# Altium project STM32F103C8.PrjPcb
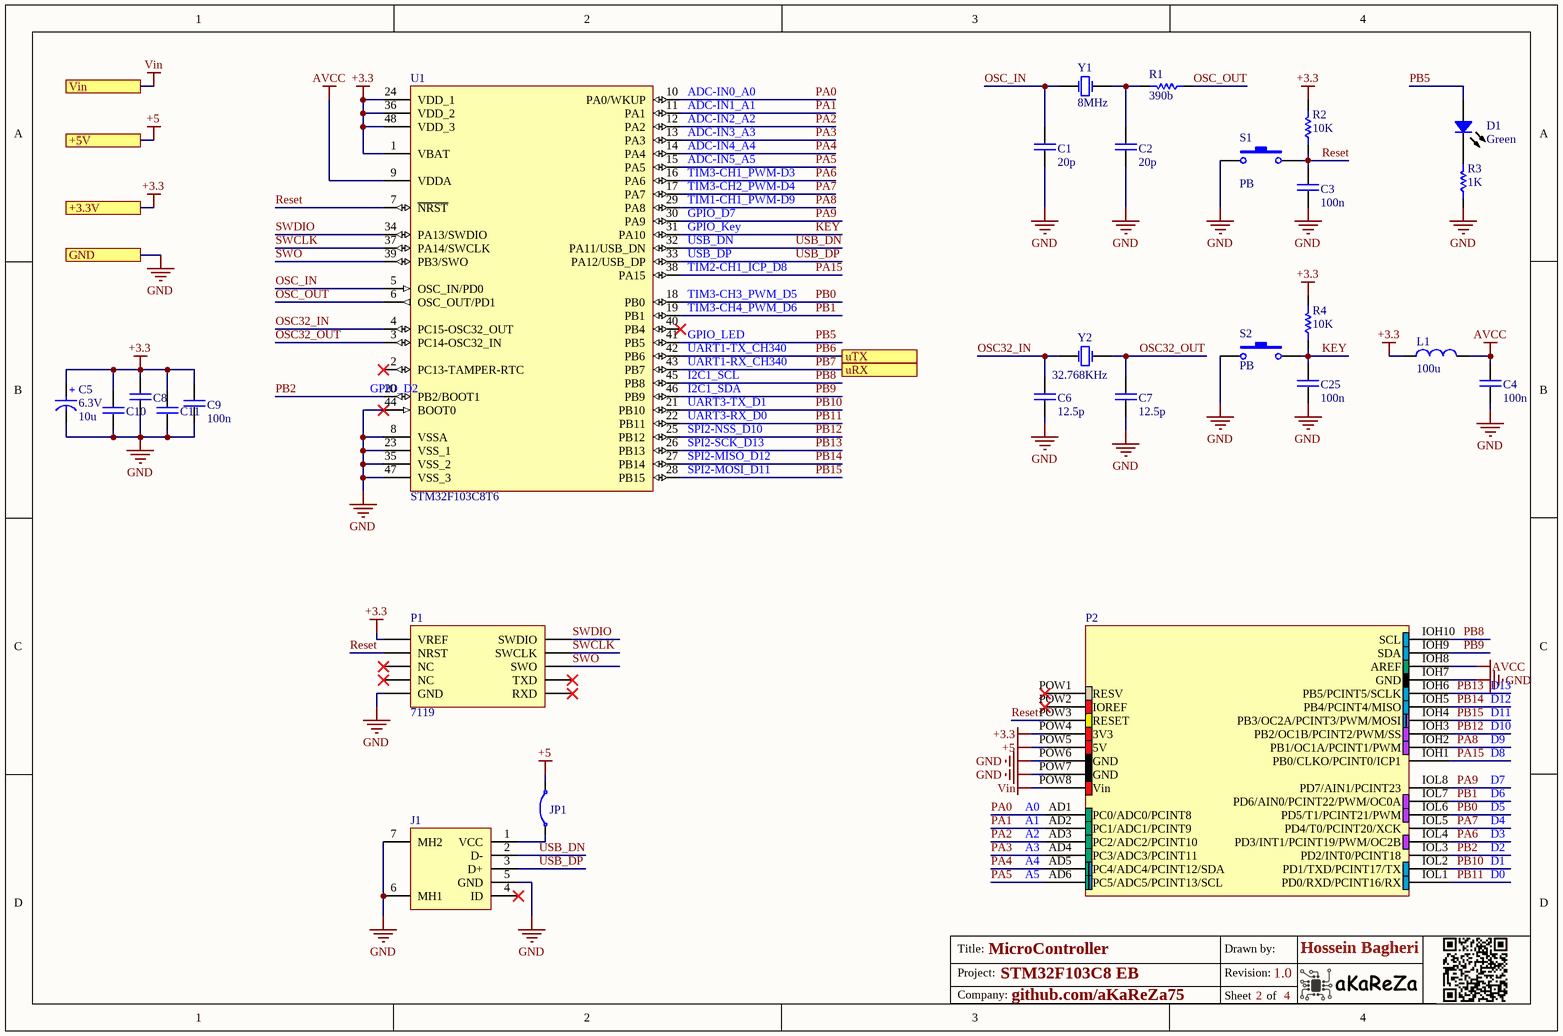
[diagram p0: MicroController.SchDoc]
Revision: 1.0.1; Project_Name: STM32F103C8 EB; CompanyName: github.com/aKaReZa75
2 sheets, 45 parts. Net scope: strictly hierarchical (ports join the sheet entries above them; power ports are local).
Board file: PCB.PcbDoc
Sheets:
  MicroController.SchDoc
  USBtoTTL.SchDoc

## Sheet MicroController.SchDoc: MicroController
size A4; Revision: 1.0; SheetNumber: 2; SheetTotal: 4

### Parts
C1  20p  [CAP 0603/1608]
C2  20p  [CAP 0603/1608]
C3  100n  [CAP 0805/2012]
C4  100n  [CAP 0805/2012]
C5  Rating: 6.3V  [SMT_C_Tantalum_A]  (hidden comment: 10u)
C6  12.5p  [CAP 0603/1608]
C7  12.5p  [CAP 0603/1608]
C8  100n  [CAP 0805/2012]  (value not drawn)
C9  100n  [CAP 0805/2012]
C10  100n  [CAP 0805/2012]  (value not drawn)
C11  100n  [CAP 0805/2012]  (value not drawn)
C25  100n  [CAP 0805/2012]
D1  Green  [LED 0805/2012 GREEN]
J1  Micro  [USB_Micro_Standard]  (value not drawn)
JP1  Jumper  [RESC2012M (0805)]  (value not drawn)
L1  100u  [IND0805]
P1  Inflow: 7119  [IDC2.54-10PIN]  (hidden comment: STLinkV3-minie)
P2  UNO  [ARDUINO_UNO_CONNECTOR]  (value not drawn)
R1  390b  [RES 0805 (2012X06L)]
R2  10K  [RES 0805 (2012X06L)]
R3  1K  [RES 0805 (2012X06L)]
R4  10K  [RES 0805 (2012X06L)]
S1  PB  [SW_PB_SMD_2PIN_SPST_6X3X2]
S2  PB  [SW_PB_SMD_2PIN_SPST_6X3X2]
U1  STM32F103C8T6  [LQFP48_N]
Y1  8MHz  [XTL_2_5032]
Y2  32.768KHz  [XTL_2_3215]

### Ports
+3.3V, +5V, GND, uRX, uTX, Vin

### Nets
+3.3: C5.1(+) C8.1 C9.1 C10.1 C11.1 L1.1 P1.10(VREF) P2.POW4(3V3) R2.2 R4.2 U1.1(VBAT) U1.24(VDD_1) U1.36(VDD_2) U1.48(VDD_3) ; port +3.3V
+5: JP1.2 P2.POW5(5V) ; port +5V
AVCC: C4.1 L1.2 P2.IOH8(AREF) U1.9(VDDA)
GND: C1.2 C2.2 C3.2 C4.2 C5.2(-) C6.2 C7.2 C8.2 C9.2 C10.2 C11.2 C25.2 J1.5(GND) J1.6(MH1) J1.7(MH2) P1.2(GND) P2.IOH7(GND) P2.POW6(GND) P2.POW7(GND) R3.1 S1.1 S2.2 U1.8(VSSA) U1.23(VSS_1) U1.35(VSS_2) U1.44(BOOT0) U1.47(VSS_3) ; port GND
Vin: P2.POW8(Vin) ; port Vin
KEY: C25.1 R4.1 S2.1 U1.31(PA10)
OSC32_IN: C6.1 U1.4(PC15-OSC32_OUT) Y2.1(OSC1)
OSC32_OUT: C7.1 U1.3(PC14-OSC32_IN) Y2.2(OSC2)
OSC_IN: C1.1 U1.5(OSC_IN/PD0) Y1.1(OSC1)
OSC_OUT: R1.1 U1.6(OSC_OUT/PD1)
PA0: P2.AD1(PC0/ADC0/PCINT8) U1.10(PA0/WKUP)
PA1: P2.AD2(PC1/ADC1/PCINT9) U1.11(PA1)
PA2: P2.AD3(PC2/ADC2/PCINT10) U1.12(PA2)
PA3: P2.AD4(PC3/ADC3/PCINT11) U1.13(PA3)
PA4: P2.AD5(PC4/ADC4/PCINT12/SDA) U1.14(PA4)
PA5: P2.AD6(PC5/ADC5/PCINT13/SCL) U1.15(PA5)
PA6: P2.IOL4(PD3/INT1/PCINT19/PWM/OC2B) U1.16(PA6)
PA7: P2.IOL5(PD4/T0/PCINT20/XCK) U1.17(PA7)
PA8: P2.IOH2(PB1/OC1A/PCINT1/PWM) U1.29(PA8)
PA9: P2.IOL8(PD7/AIN1/PCINT23) U1.30(PA9)
PA15: P2.IOH1(PB0/CLKO/PCINT0/ICP1) U1.38(PA15)
PB0: P2.IOL6(PD5/T1/PCINT21/PWM) U1.18(PB0)
PB1: P2.IOL7(PD6/AIN0/PCINT22/PWM/OC0A) U1.19(PB1)
PB2: P2.IOL3(PD2/INT0/PCINT18) U1.20(PB2/BOOT1)
PB5: D1.1 U1.41(PB5)
PB6: U1.42(PB6) ; port uTX
PB7: U1.43(PB7) ; port uRX
PB8: P2.IOH10(SCL) U1.45(PB8)
PB9: P2.IOH9(SDA) U1.46(PB9)
PB10: P2.IOL2(PD1/TXD/PCINT17/TX) U1.21(PB10)
PB11: P2.IOL1(PD0/RXD/PCINT16/RX) U1.22(PB11)
PB12: P2.IOH3(PB2/OC1B/PCINT2/PWM/SS) U1.25(PB12)
PB13: P2.IOH6(PB5/PCINT5/SCLK) U1.26(PB13)
PB14: P2.IOH5(PB4/PCINT4/MISO) U1.27(PB14)
PB15: P2.IOH4(PB3/OC2A/PCINT3/PWM/MOSI) U1.28(PB15)
Reset: C3.1 P1.8(NRST) P2.POW3(RESET) R2.1 S1.2 U1.7(~{NRST})
SWCLK: P1.7(SWCLK) U1.37(PA14/SWCLK)
SWDIO: P1.5(SWDIO) U1.34(PA13/SWDIO)
SWO: P1.9(SWO) U1.39(PB3/SWO)
USB_DN: J1.2(D-) U1.32(PA11/USB_DN)
USB_DP: J1.3(D+) U1.33(PA12/USB_DP)
NetC2_1: C2.1 R1.2 Y1.2(OSC2)
NetD1_2: D1.2 R3.2
NetJ1_1: J1.1(VCC) JP1.1

Not connected (* = marked no-connect by the designer): J1 4(ID)*; P1 1(NC)* 3(NC)* 4(TXD)* 6(RXD)*; P2 POW1(RESV)* POW2(IOREF)*; U1 2(PC13-TAMPER-RTC)* 40(PB4)*

### Notes on the sheet
- (near U1) ADC-IN0_A0
- (near U1) ADC-IN1_A1
- (near U1) TIM3-CH1_PWM-D3
- (near U1) ADC-IN2_A2
- (near U1) ADC-IN3_A3
- (near U1) ADC-IN4_A4
- (near U1) ADC-IN5_A5
- (near U1) TIM3-CH2_PWM-D4
- (near U1) TIM1-CH1_PWM-D9
- (near U1) USB_DN
- (near U1) GPIO_D7
- (near U1) GPIO_Key
- (near U1) TIM3-CH3_PWM_D5
- (near U1) TIM3-CH4_PWM_D6
- (near U1) TIM2-CH1_ICP_D8
- (near U1) USB_DP
- (near U1) I2C1_SCL
- (near U1) UART1-RX_CH340
- (near U1) UART1-TX_CH340
- (near U1) GPIO_LED
- (near U1) GPIO_D2
- (near U1) UART3-RX_D0
- (near U1) UART3-TX_D1
- (near U1) SPI2-NSS_D10
- (near U1) SPI2-SCK_D13
- (near U1) I2C1_SDA
- (near U1) SPI2-MISO_D12
- (near U1) SPI2-MOSI_D11
- D11
- D12
- D13
- D7
- D8
- D9
- D10
- (near P2) A0
- (near P2) A1
- (near P2) A2
- (near P2) A3
- D2
- D3
- D4
- D5
- D6
- (near P2) A4
- (near P2) A5
- D0
- D1
- Title:
- Project:
- Drawn by:
- Revision:
- Hossein Bagheri
- Company:
- Sheet
- of

### Library data of the parts
C1 C2 C6 C7 = Cap_Multi_SMD: Bipolar ceramic capacitor SMD; Inflow: inflow?; Type: Type?; Validation: Valid; Rating: Rating?; Package: 0603
  C1 C2: Value: 20p
  C6 C7: Value: 12.5p
C3 C4 C8-C11 C25 = Cap_Multi_SMD_100nF_0805: Bipolar ceramic capacitor SMD; Inflow: inflow?; Type: MultiLayer; Rating: 50V; Validation: Valid; Package: 0805; Value: 100n
C5 = Cap_Tantalum: Tantalum Capacitor,TAJ Series-SMD; Inflow: inflow?; Validation: Valid; Package: Package?; Type: Tantalum; Value: 10u
D1 = Semi_LED_SMD: LED; Inflow: inflow?; Rating: Rating?; Validation: Valid; Package: Package?; Type: LED; Value: Green
J1 = Con_USB2_Micro: USB micro female; Rating: Rating?; Validation: NT; Inflow: inflow?; Value: Micro; Package: Package?; Type: Type?
JP1 = Other_Elec_Jumper_0805: Jumper Component; Rating: Rating?; Inflow: inflow?; Validation: Valid; Type: Type?; Package: 0805; Value: Jumper
L1 = Ind_SMD_0805: Inductor; Inflow: inflow?; Type: SMD; Rating: Rating?; Validation: Valid; Package: 0805; Value: 100u
P1 = Con_Prog_STLinkV3_SWD: STLINK-V3MINIE debugger/programmer IDC probe for STM32 microcontrollers; Rating: Rating?; Validation: NT; Value: STLinkV3-minie; Package: Package?; Type: SWD
P2 = Con_Arduino_UNO_Con: Arduino UNO Connector; Rating: Rating?; Inflow: inflow?; Validation: NT; Value: UNO; Package: Package?; Type: Type?
R1-R4 = Res_SMD_0805: Resistor; Inflow: inflow?; Rating: 0.125W; Validation: Valid; Package: 0805; Type: 10%
  R1: Value: 390b
  R2 R4: Value: 10K
  R3: Value: 1K
S1 S2 = SW_PushButton_2_SMD: SMT Tactile ‎Switch; Rating: 2b; Validation: Valid; Inflow: 8260; Type: Vertical; Package: SMD; Value: PB
U1 = IC_MCU_STM32F103C8T6: 32-Bit mircrocontroller; Validation: NT; Rating: CORTEX-M3; Inflow: inflow?; Type: Microcontroller; Package: LQFP48; Value: STM32F103C8T6
Y1 = Other_Elec_Xtal_8MHZ_SMD: Crystal Oscillator; Rating: 10ppm; Inflow: inflow?; Validation: NT; Package: 5032; Type: Crystal; Value: 8MHz
Y2 = Other_Elec_Xtal_32.768K_SMD: Crystal Oscillator; Rating: 20ppm; Inflow: inflow?; Validation: NT; Package: 3215; Type: Crystal; Value: 32.768KHz

## Sheet USBtoTTL.SchDoc: USBtoTTL
size A4; SheetNumber: 4; SheetTotal: 4
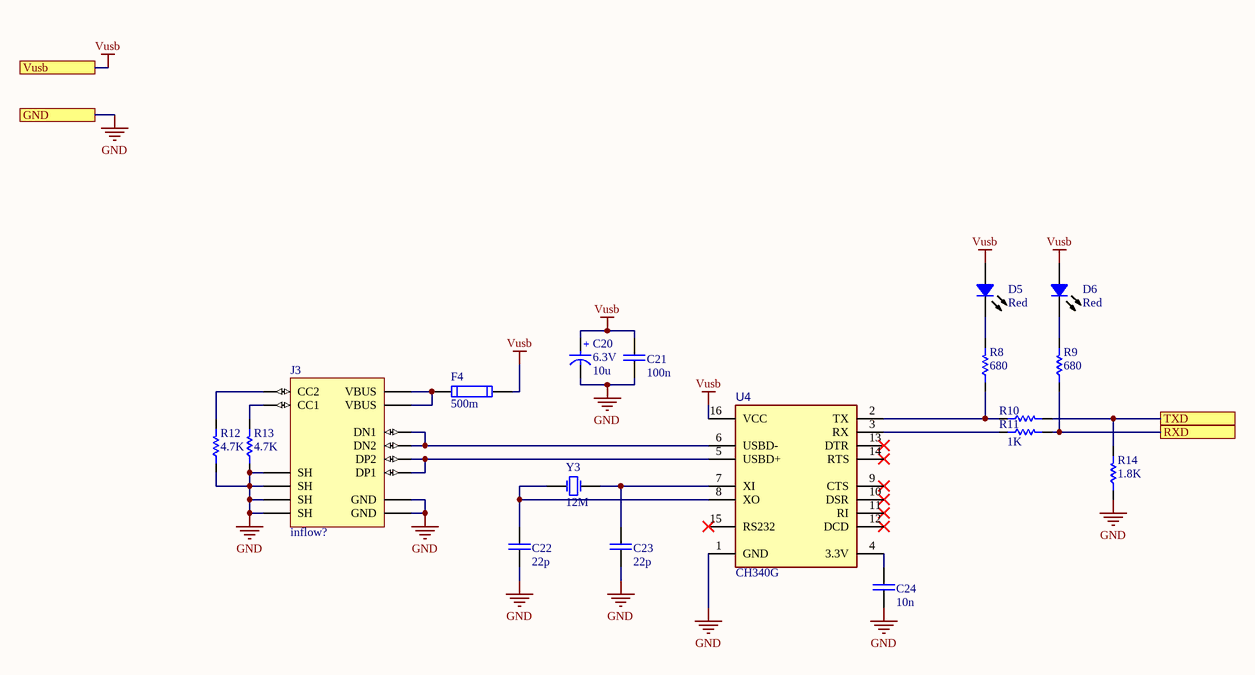
[diagram p1: USBtoTTL.SchDoc]

### Parts
C20  Rating: 6.3V  [SMT_C_Tantalum_A]  (hidden comment: 10u)
C21  100n  [CAP 0805/2012]
C22  22p  [CAP 0805/2012]
C23  22p  [CAP 0805/2012]
C24  10n  [CAP 0805/2012]
D5  Red  [LED 0805/2012 RED]
D6  Red  [LED 0805/2012 RED]
F4  500m  [1206_F]
J3  Inflow: inflow?  [HRO_TYPE-C-31-M-12 - Extended]  (hidden comment: 12b)
R8  680  [RES 0805 (2012X06L)]
R9  680  [RES 0805 (2012X06L)]
R10  1K  [RES 0805 (2012X06L)]  (value not drawn)
R11  1K  [RES 0805 (2012X06L)]
R12  4.7K  [RES 0805 (2012X06L)]
R13  4.7K  [RES 0805 (2012X06L)]
R14  1.8K  [RES 0805 (2012X06L)]
U4  CH340G  [SO16_M]
Y3  12M  [Crystal SMD]

### Ports
GND, RXD, TXD, Vusb

### Nets
GND: C20.2(-) C21.2 C22.2 C23.2 C24.2 J3.A1_B12(GND) J3.B1_A12(GND) J3.S1(SH) J3.S2(SH) J3.S3(SH) J3.S4(SH) R12.1 R13.1 R14.1 U4.1(GND) ; port GND
Vusb: C20.1(+) C21.1 D5.1 D6.1 F4.2 U4.16(VCC) ; port Vusb
RXD: R9.1 R11.2 ; port RXD
TXD: R10.2 R14.2 ; port TXD
NetC22_1: C22.1 U4.8(XO) Y3.1(OSC1)
NetC23_1: C23.1 U4.7(XI) Y3.2(OSC2)
NetC24_1: C24.1 U4.4(3.3V)
NetD5_2: D5.2 R8.2
NetD6_2: D6.2 R9.2
NetF4_1: F4.1 J3.A4_B9(VBUS) J3.B4_A9(VBUS)
NetJ3_A5: J3.A5(CC1) R13.2
NetJ3_A6: J3.A6(DP1) J3.B6(DP2) U4.5(USBD+)
NetJ3_A7: J3.A7(DN1) J3.B7(DN2) U4.6(USBD-)
NetJ3_B5: J3.B5(CC2) R12.2
NetR8_1: R8.1 R10.1 U4.2(TX)
NetR11_1: R11.1 U4.3(RX)

Not connected (* = marked no-connect by the designer): U4 9(CTS)* 10(DSR)* 11(RI)* 12(DCD)* 13(DTR)* 14(RTS)* 15(RS232)*

### Notes on the sheet
- Title:
- Project:
- Drawn by:
- Revision:
- Hossein Bagheri
- Company:
- Sheet
- of

### Library data of the parts
C20 = Cap_Tantalum: as C5 on sheet MicroController; Package: Package?; Type: Tantalum; Value: 10u
C21 = Cap_Multi_SMD_100nF_0805: as C3 on sheet MicroController; Package: 0805; Value: 100n
C22-C24 = Cap_Multi_SMD_0805: Bipolar ceramic capacitor SMD; Inflow: inflow?; Type: MultiLayer; Rating: Rating?; Validation: Valid; Package: 0805
  C22 C23: Value: 22p
  C24: Value: 10n
D5 D6 = Semi_LED_SMD: as D1 on sheet MicroController; Package: Package?; Type: LED; Value: Red
F4 = Other_Elec_Fuse_SMD: Short circiut  protection; Inflow: inflow?; Type: Fast; Rating: Rating?; Validation: Valid; Package: 1206; Value: 500m
J3 = Con_USB_C: USB C Female Connector; Rating: Rating?; Validation: Valid; Value: 12b; Package: SMD; Type: C
R8-R14 = Res_SMD_0805: as R1 on sheet MicroController; Package: 0805; Type: 10%
  R8 R9: Value: 680
  R10 R11: Value: 1K
  R12 R13: Value: 4.7K
  R14: Value: 1.8K
U4 = IC_Converter_CH340G: TTL To USB Chip; Rating: Rating?; Validation: Valid; Inflow: inflow?; Type: USB to TTL; Package: SO-16; Value: CH340G
Y3 = Other_Elec_Xtal_SMD: Crystal Oscillator; Rating: Rating?; Inflow: inflow?; Validation: Valid; Package: SMD; Type: Quartz; Value: 12M